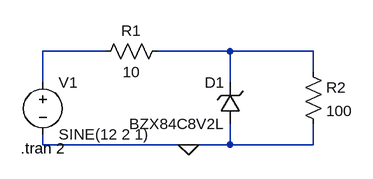
[diagram p0: schematic zener_regulator_test.asc]
zener_regulator_test.asc, the LTspice schematic file:
Version 4
SHEET 1 880 680
WIRE 16 64 -80 64
WIRE 208 64 96 64
WIRE 336 64 208 64
WIRE 336 96 336 64
WIRE -80 112 -80 64
WIRE 208 112 208 64
WIRE -80 208 -80 192
WIRE 144 208 -80 208
WIRE 208 208 208 176
WIRE 208 208 144 208
WIRE 336 208 336 176
WIRE 336 208 208 208
FLAG 144 208 0
SYMBOL voltage -80 96 R0
WINDOW 123 0 0 Left 0
WINDOW 39 0 0 Left 0
SYMATTR InstName V1
SYMATTR Value SINE(12 2 1)
SYMBOL zener 224 176 R180
WINDOW 0 24 64 Left 2
WINDOW 3 24 0 Left 2
SYMATTR InstName D1
SYMATTR Value BZX84C8V2L
SYMBOL res 112 48 R90
WINDOW 0 0 56 VBottom 2
WINDOW 3 32 56 VTop 2
SYMATTR InstName R1
SYMATTR Value 10
SYMBOL res 320 80 R0
SYMATTR InstName R2
SYMATTR Value 100
TEXT -114 214 Left 2 !.tran 2

The netlist it stands for:
* zener_regulator_test.asc
V1 N001 0 SINE(12 2 1)
D1 0 N002 BZX84C8V2L
R1 N002 N001 10
R2 N002 0 100
.model D D
.lib standard.dio
.tran 2
.backanno
.end